# EAGLE design adapter (EAGLE 9.6.2)
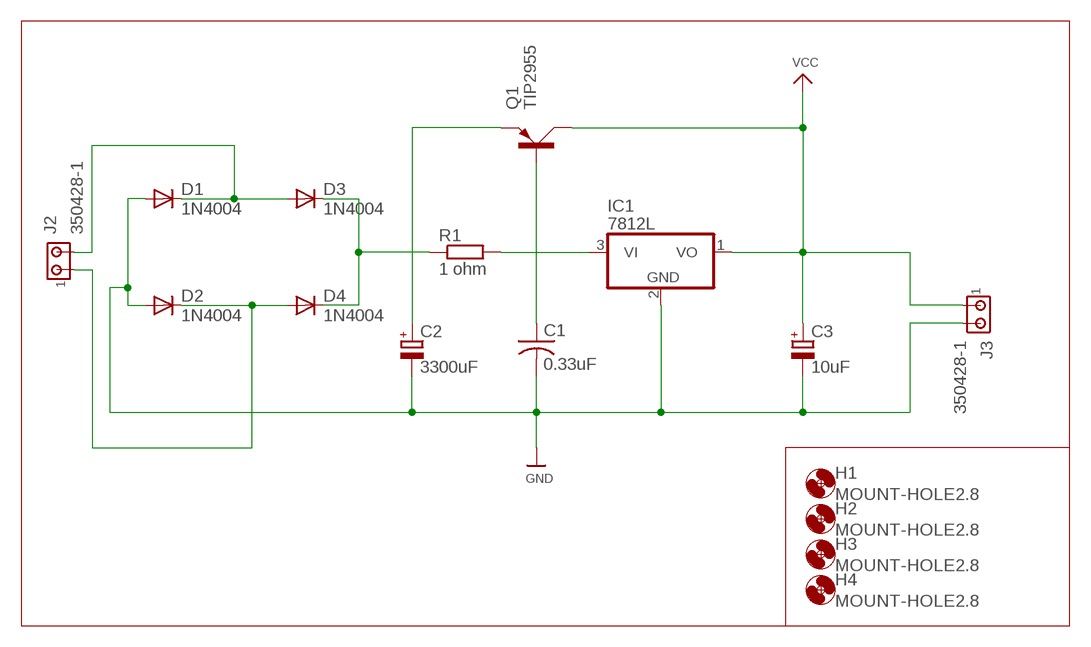
[diagram p0: schematic, sheet 1]

## Parts
C1  0.33uF  C-US025-024X044  [C025-024X044]
C2  3300uF  C-POL_RADIAL-11MM-DIA  [CAPPRD508W65D1000H1100B]
C3  10uF  C-POL_RADIAL-11MM-DIA  [CAPPRD508W65D1000H1100B]
D1  1N4004  [DO41-10]
D2  1N4004  [DO41-10]
D3  1N4004  [DO41-10]
D4  1N4004  [DO41-10]
H1  MOUNT-HOLE2.8  [2,8]
H2  MOUNT-HOLE2.8  [2,8]
H3  MOUNT-HOLE2.8  [2,8]
H4  MOUNT-HOLE2.8  [2,8]
IC1  7812L  [TO92]
J2  350428-1  [350428-1]
J3  350428-1  [350428-1]
Q1  TIP2955  [TOP3AV]
R1  1 ohm  R-EU_0204/7  [0204/7]

## Nets
GND: C1.2 C2.2(-) C3.2(-) D1.A D2.A IC1.2(GND) J3.2
N$1: D1.C D3.A J2.2
N$2: D2.C D4.A J2.1
N$3: D3.C D4.C R1.1
N$5: IC1.3(VI) R1.2
N$6: C2.1(+) Q1.E
N$7: C1.1 Q1.B
VCC: C3.1(+) IC1.1(VO) J3.1 Q1.C

## Library data of the parts
C1 = adafruit:C-US: CAPACITOR, American symbol
C2 C3 = Capacitor:C-POL: Capacitor Polarised - Generic; CATEGORY: Capacitor
D1-D4 = adafruit:1N4004: DIODE General purpose 1N400x type rectifier (With bigger pads) http://www.ladyada.net/library/pcb/eaglelibrary.html
H1-H4 = holes:MOUNT-HOLE: MOUNTING HOLE with drill center marker
IC1 = linear 2:78*: Positive VOLTAGE REGULATOR Source: http://cache.national.com/ds/LM/LM78L05.pdf http://www.fairchildsemi.com/ds/LM/LM7805.pdf
J2 J3 = con-amp:350428-1: Universal MATE-N-LOK .250" Centerline, 600 V, 19 - 36 A max Source: http://catalog.tycoelectronics.com/ .. ENG_CD_350428_Y.pdf
Q1 = TIP2955:TIP2955: PNP TRANSISTOR; CHECK_PRICES: https://www.snapeda.com/parts/TIP2955/STMicroelectronics/view-part/?ref=eda; DESCRIPTION: Bipolar (BJT) Transistor PNP 60 V 15 A - 90 W Through Hole TO-247-3; DIGIKEY_PART_NUMBER: 497-2608-5-ND; MF: STMicroelectronics; MP: TIP2955; PACKAGE: TO-247 STMicroelectronics; PURCHASE-URL: https://www.snapeda.com/api/url_track_click_mouser/?unipart_id=4791923&manufacturer=STMicroelectronics&part_name=TIP2955&search_term=tip2955; SNAPEDA_LINK: https://www.snapeda.com/parts/TIP2955/STMicroelectronics/view-part/?ref=snap
R1 = rcl:R-EU_: RESISTOR, European symbol; SPICEPREFIX: R

## Board
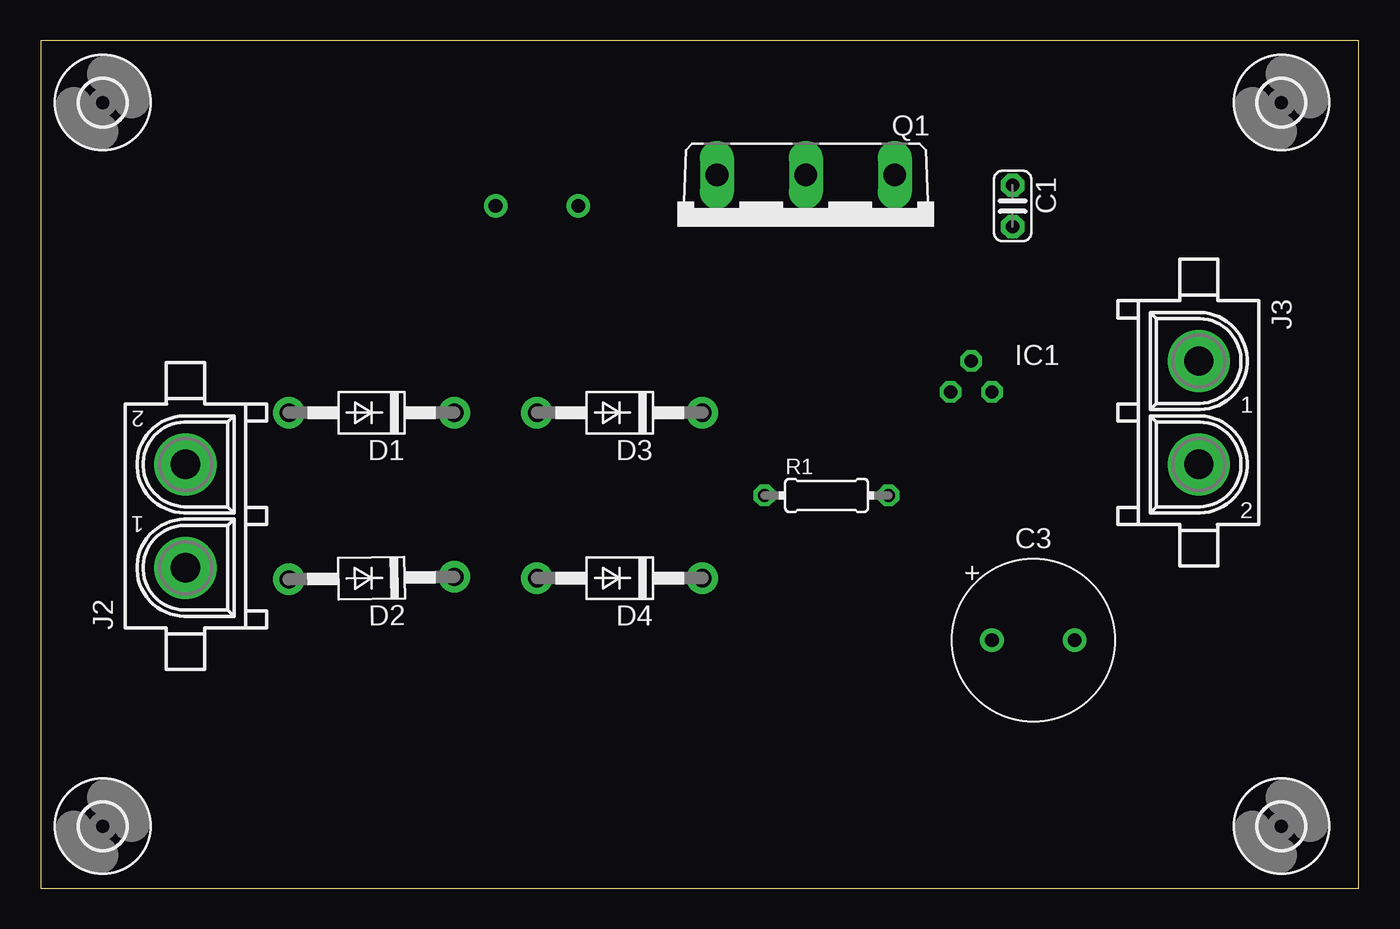
[diagram p1: board, top side]
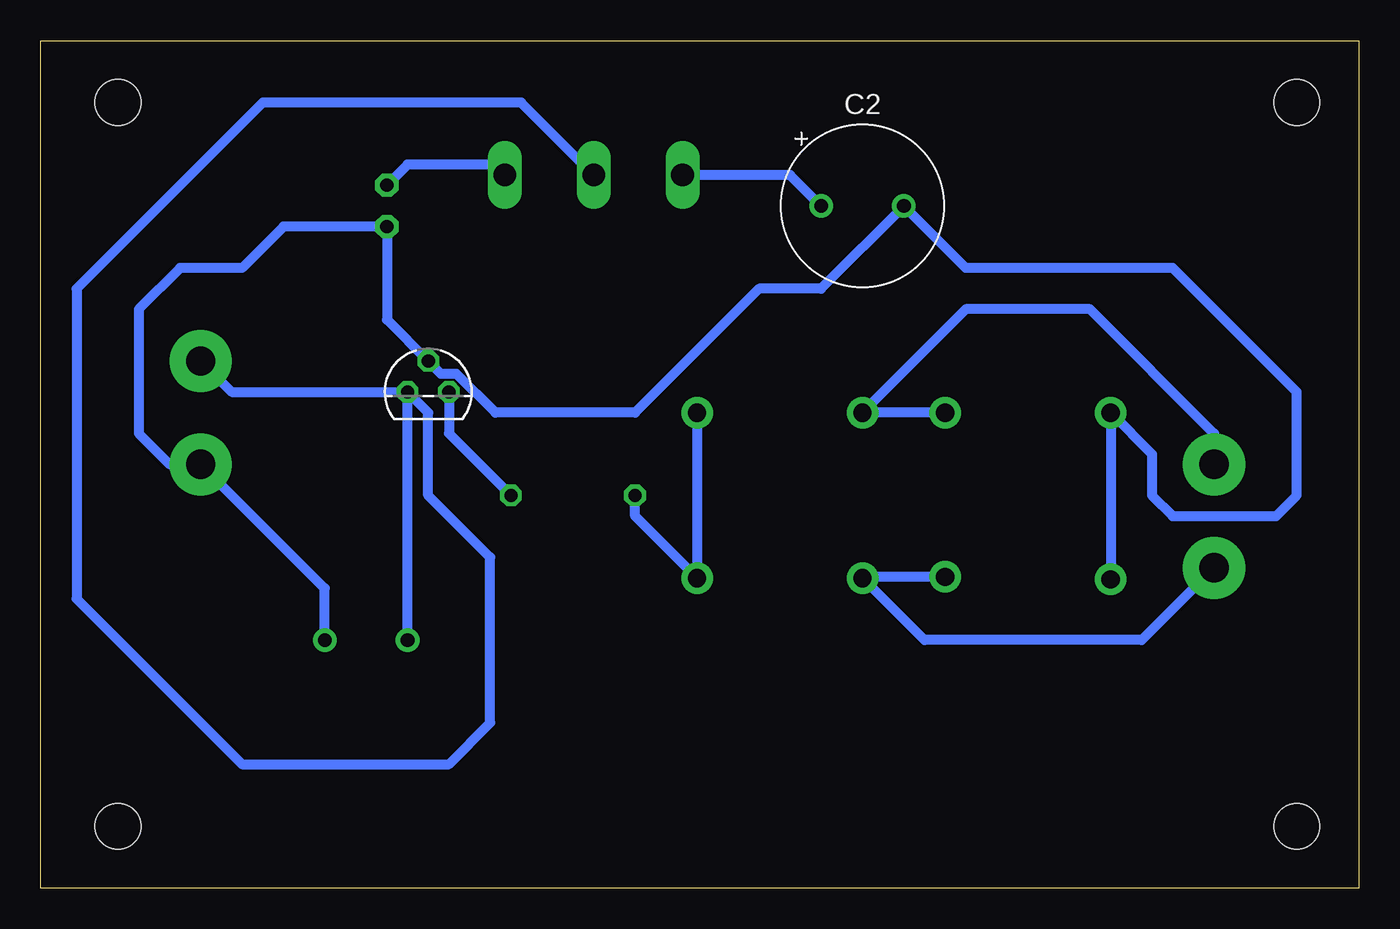
[diagram p2: board, bottom side, seen from below]

Size 80.95 x 52.06 mm. Coordinates in mm from the lower left corner, seen from the top.
Outline: 0,0 80.95,0 80.95,52.06 0,52.06 0,0
Copper layers (1*16): Top 0.035mm / dielectric 1.5mm / Bottom 0.035mm
Design rules "default": minimum track width 6mil, minimum drill 0.35mm, track to track 6mil, track to pad 6mil, pad to pad 6mil, via to via 6mil, smd to smd 6mil, copper to edge 40mil, drill to drill 6mil, minimum pad ring 10mil, minimum via ring 8mil, stop-mask expansion 4mil, vias tented up to drill 0mil, thermal gap 10mil

### Footprints (pad centres in the part's own frame; a part is rotated, then mirrored left to right if it is on the bottom)
C025-024X044 = drill 0.813 pad 1.422 octagon: 1 -1.27,0; 2 1.27,0
CAPPRD508W65D1000H1100B = drill 0.85 pad 1.45: 1 -2.54,0; 2 2.54,0
DO41-10 = drill 1.118 pad 1.93: A 5.08,0; C -5.08,0
2,8 = hole 2.8: 0,0
TO92 = drill 0.813 octagon: 1 -1.27,0; 2 0,1.905; 3 1.27,0
350428-1 = drill 1.8 pad 3.81: 1 -3.175,0; 2 3.175,0
TOP3AV = drill 1.397 long: B -5.461,-3.175; C 0,-3.175; E 5.461,-3.175
0204/7 = drill 0.813 octagon: 1 -3.81,0; 2 3.81,0

### Placement (x,y rotation side)
C1  59.69,41.91 270 top
C2  30.48,41.91 0 bottom
C3  60.96,15.24 0 top
D1  20.32,29.21 180 top
D2  20.32,19.05 180.9 top
D3  35.56,29.21 180 top
D4  35.56,19.05 180 top
H1  3.81,48.26 0 top
H2  3.81,3.81 0 top
H3  76.2,48.26 0 top
H4  76.2,3.81 0 top
IC1  57.15,30.48 0 bottom
J2  8.89,22.86 90 top
J3  71.12,29.21 270 top
Q1  46.99,40.64 180 top
R1  48.26,24.13 0 top

### Tracks (layer width: path | path; a pad name or v marks a point on that pad's centre or on a via)
GND
  Bottom 0.61: D2.A D1.A 12.7,26.67 12.7,24.13 11.43,22.86 5.08,22.86 3.81,24.13 3.81,30.48 11.43,38.1 24.13,38.1 C2.2 33.02,36.83 36.83,36.83 44.45,29.21 53.03,29.21 55.42,31.6 56.36,31.6 IC1.2 59.69,34.92 C1.2 66.04,40.64 68.58,38.1 72.39,38.1 74.93,35.56 74.93,27.94 73.03,26.04 J3.2 63.5,18.41 C3.2
N$1
  Bottom 0.61: D1.C D3.A 24.13,35.56 16.51,35.56 8.89,27.94 J2.2
N$2
  Bottom 0.61: D2.C 30.4,19.13 D4.A 26.67,15.24 13.33,15.24 J2.1
N$3
  Bottom 0.61: D3.C D4.C 44.45,22.86 R1.1
N$5
  Bottom 0.61: IC1.3 55.88,27.94 R1.2
N$6
  Bottom 0.61: C2.1 34.93,43.81 Q1.E
N$7
  Bottom 0.61: Q1.B 53.09,44.45 58.42,44.45 C1.1
VCC
  Bottom 0.61: J3.1 69.22,30.48 IC1.1 | C3.1 IC1.1 | Q1.C 51.44,48.26 67.31,48.26 78.74,36.83 78.74,17.78 68.58,7.62 55.88,7.62 53.34,10.16 53.34,20.32 57.15,24.13 57.15,29.21 IC1.1